# Altium project ELN2_LaboAntenna_Bornet_Cesalli_Lehtinen.PrjPcb
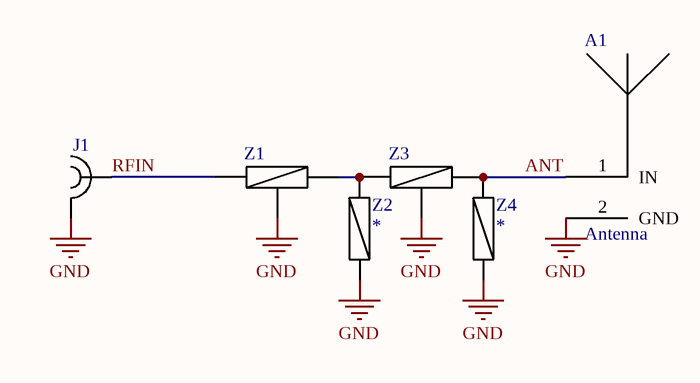
[diagram p0: ELN2_LaboAntenna.SchDoc]
PcbDate: 2022-01-20; PcbDesigner: GregTrack; PcbRevision: 1.0; ProjectName: GregTrack_SMALL_LTE_v1.0; SchematicDate: 2022-01-20; SchematicDesigner: ANX; SchematicRevision: 1.0
1 sheet, 6 parts. Net scope: global (net labels, ports and power ports of the same name join across sheets).
Board file: ELN2_LaboAntenna.PcbDoc

## Sheet ELN2_LaboAntenna.SchDoc: PCA10090 - nRF9160
size A3; Organization: Nordic Semiconductor; DocumentNumber: 2; SheetNumber: 2; SheetTotal: 8; CompanyName: Nordic Semiconductor; DocumentSize: A3; ProjectName: GregTrack_SMALL_LTE_v1.0

### Parts
A1  Antenna  [Antenna]  (net tie, no BOM)
J1  CONSMA001-G  [SMA EDGE Molex 732511150]  (value not drawn)
Z1  (no value)  [Matching pad 1005 with Ground]
Z2  *  [Matching pad 1005]
Z3  (no value)  [Matching pad 1005 with Ground]
Z4  *  [Matching pad 1005]

### Nets
GND: A1.2(GND) J1.2 Z1.3(GND) Z2.1 Z3.3(GND) Z4.1
ANT: A1.1(IN) Z3.2 Z4.2
RFIN: J1.1 Z1.1
NetZ1_2: Z1.2 Z2.2 Z3.1

### Notes on the sheet
- Date :
- Revision :
- Sheet
- of
- Design by :

### Library data of the parts
J1 = SMA EDGE Molex 732511150: Value: CONSMA001-G
Z1 Z3 = Matching pad with ground: Antenna matching pad with ground
Z2 Z4 = Matching pad: Value: *